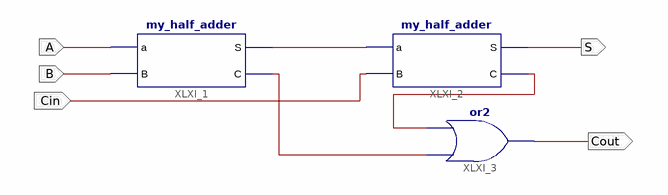
[diagram p0: schematic sheet 1]
// Xilinx ISE schematic full_adder.sch (spartan3) as structural Verilog: 3 symbols, 5 ports
module full_adder (
  input  Cin,
  input  A,
  input  B,
  output S,
  output Cout
);

  wire XLXN_1, XLXN_2, XLXN_3;

  my_half_adder XLXI_1 (.a(A), .B(B), .S(XLXN_1), .C(XLXN_2));
  my_half_adder XLXI_2 (.a(XLXN_1), .B(Cin), .S(S), .C(XLXN_3));
  or XLXI_3 (Cout, XLXN_2, XLXN_3);
endmodule
